# Altium schematic sheet Temperature and Humidity.SchDoc
size A
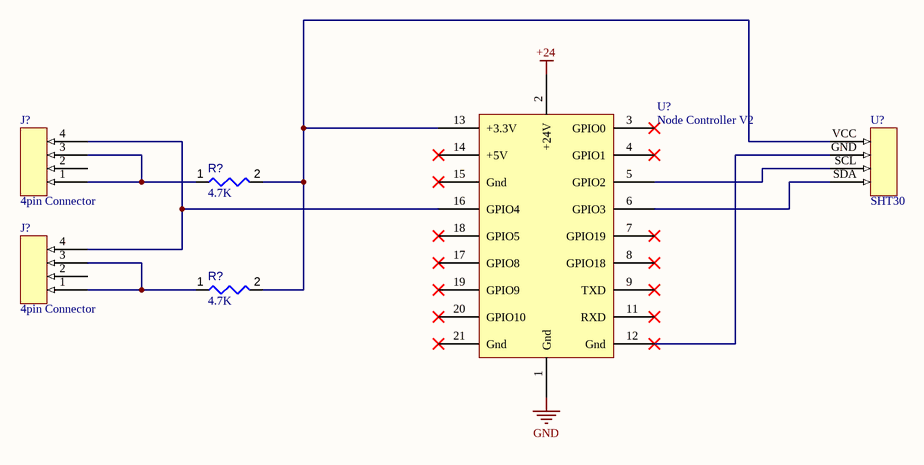
[diagram p0: Temperature and Humidity.SchDoc]

## Parts
(Parts that share a designator on the sheet are numbered #1, #2 ... from top to bottom, then left to right.)
J?#1  4pin Connector
J?#2  4pin Connector
R?#1  value 4.7K  [RESC0402(1005)_L]  (hidden comment: Resistor 2K2  +/-5 % 0402 63 mW)
R?#2  value 4.7K  [RESC0402(1005)_L]  (hidden comment: Resistor 2K2  +/-5 % 0402 63 mW)
U?#1  SHT30
U?#2  Node Controller V2

## Nets
+24: U?#2.2(+24V)
GND: U?#2.1(Gnd)
NetJ?#1_1: J?#1.1 J?#1.3 R?#1.1
NetJ?#1_4: J?#1.4 J?#2.4 U?#2.16(GPIO4)
NetJ?#2_1: J?#2.1 J?#2.3 R?#2.1
NetR?#1_2: R?#1.2 R?#2.2 U?#1.VCC U?#2.13(+3.3V)
NetU?#1_GND: U?#1.GND U?#2.12(Gnd)
NetU?#1_SCL: U?#1.SCL U?#2.5(GPIO2)
NetU?#1_SDA: U?#1.SDA U?#2.6(GPIO3)

Not connected (* = marked no-connect by the designer): J?#1 2; J?#2 2; U?#2 3(GPIO0)* 4(GPIO1)* 7(GPIO19)* 8(GPIO18)* 9(TXD)* 11(RXD)* 14(+5V)* 15(Gnd)* 17(GPIO8)* 18(GPIO5)* 19(GPIO9)* 20(GPIO10)* 21(Gnd)*

## Library data of the parts
R?#1 R?#2 = CMP-009-00166-3: Chip Resistor, 2,2 kOhms, +/-5 %, 63 mW, -55 to 155 degC, 0402; Power: 63mW; Tolerance: 5%; Pins: 2; Min Operating Temperature: -55°C; Max Operating Temperature: 155°C; Case/Package: 0402